# EAGLE schematic MotorEncoder (EAGLE 6.3)
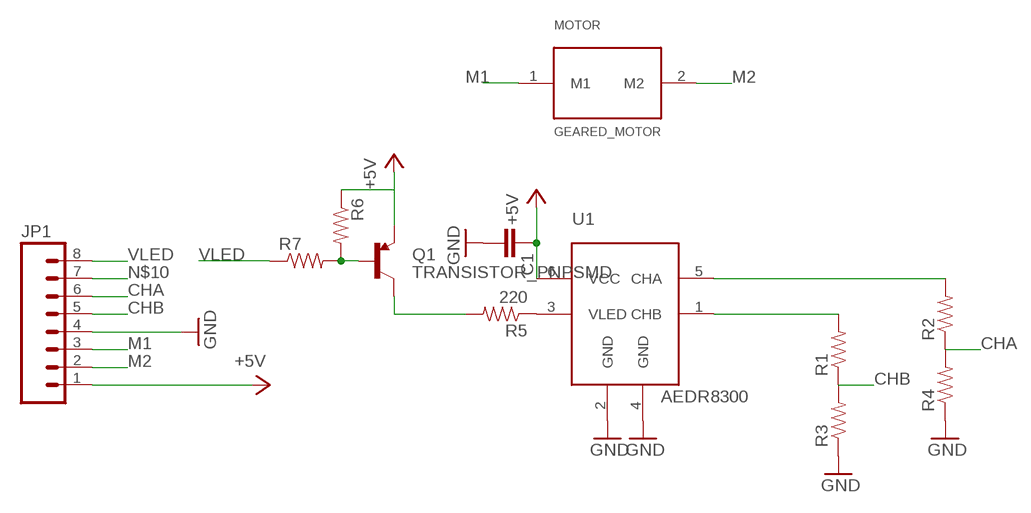
[diagram p0: schematic, sheet 1]

## Parts
C1  CAP0603-CAP  [0603-CAP]
JP1  M08BM08B-SRSS-TB  [BM08B-SRSS-TB]
MOTOR  GEARED_MOTOR  [GEARED_MOTOR]
Q1  TRANSISTOR_PNPSMD  [SOT23-3]
R1  RESISTOR0603-RES  [0603-RES]
R2  RESISTOR0603-RES  [0603-RES]
R3  RESISTOR0603-RES  [0603-RES]
R4  RESISTOR0603-RES  [0603-RES]
R5  220  RESISTOR0603-RES  [0603-RES]
R6  RESISTOR0603-RES  [0603-RES]
R7  RESISTOR0603-RES  [0603-RES]
U1  AEDR8300  [AEDR8300]

## Nets
+5V: C1.1 JP1.1 Q1.2(E) R6.1 U1.6(VCC)
CHA: JP1.6 R2.1 R4.2
CHB: JP1.5 R1.1 R3.2
GND: C1.2 JP1.4 R3.1 R4.1 U1.2(GND) U1.4(GND)
M1: JP1.3 MOTOR.1(M1)
M2: JP1.2 MOTOR.2(M2)
N$1: R5.1 U1.3(VLED)
N$2: Q1.3(C) R5.2
N$3: Q1.1(B) R6.2 R7.2
N$4: R1.2 U1.1(CHB)
N$5: R2.2 U1.5(CHA)
N$10: JP1.7
VLED: JP1.8 R7.1

## Library data of the parts
C1 = SparkFun-Passives:CAP: Capacitor Standard 0603 ceramic capacitor, and 0.1" leaded capacitor.
JP1 = SparkFun-Connectors:M08: Header 8 Standard 8-pin 0.1" header. Use with straight break away headers (SKU : PRT-00116), right angle break away headers (PRT-00553), swiss pins (PRT-00743), machine pins (PRT-00117), and female headers (PRT-00115).
MOTOR = geared-motor:GEARED_MOTOR
Q1 = SparkFun-DiscreteSemi:TRANSISTOR_PNP: Generic PNP BJT. Double check pinouts against datasheets- not all devices are the same!
R1-R7 = SparkFun-Passives:RESISTOR: Resistor Basic schematic elements and footprints for 0603, 1206, and PTH resistors.
U1 = AEDR8300:AEDR8300